# EasyEDA Pro project 430Backup.eprj

# Schematic 430Backup
Create Date: 2023-07-28; Page Name: P1; Project Name: 430Backup; Schematic Name: 430Backup; Update Date: 2023-07-28; Company: 嘉立创EDA; Page Size: A4; Version: V1.0
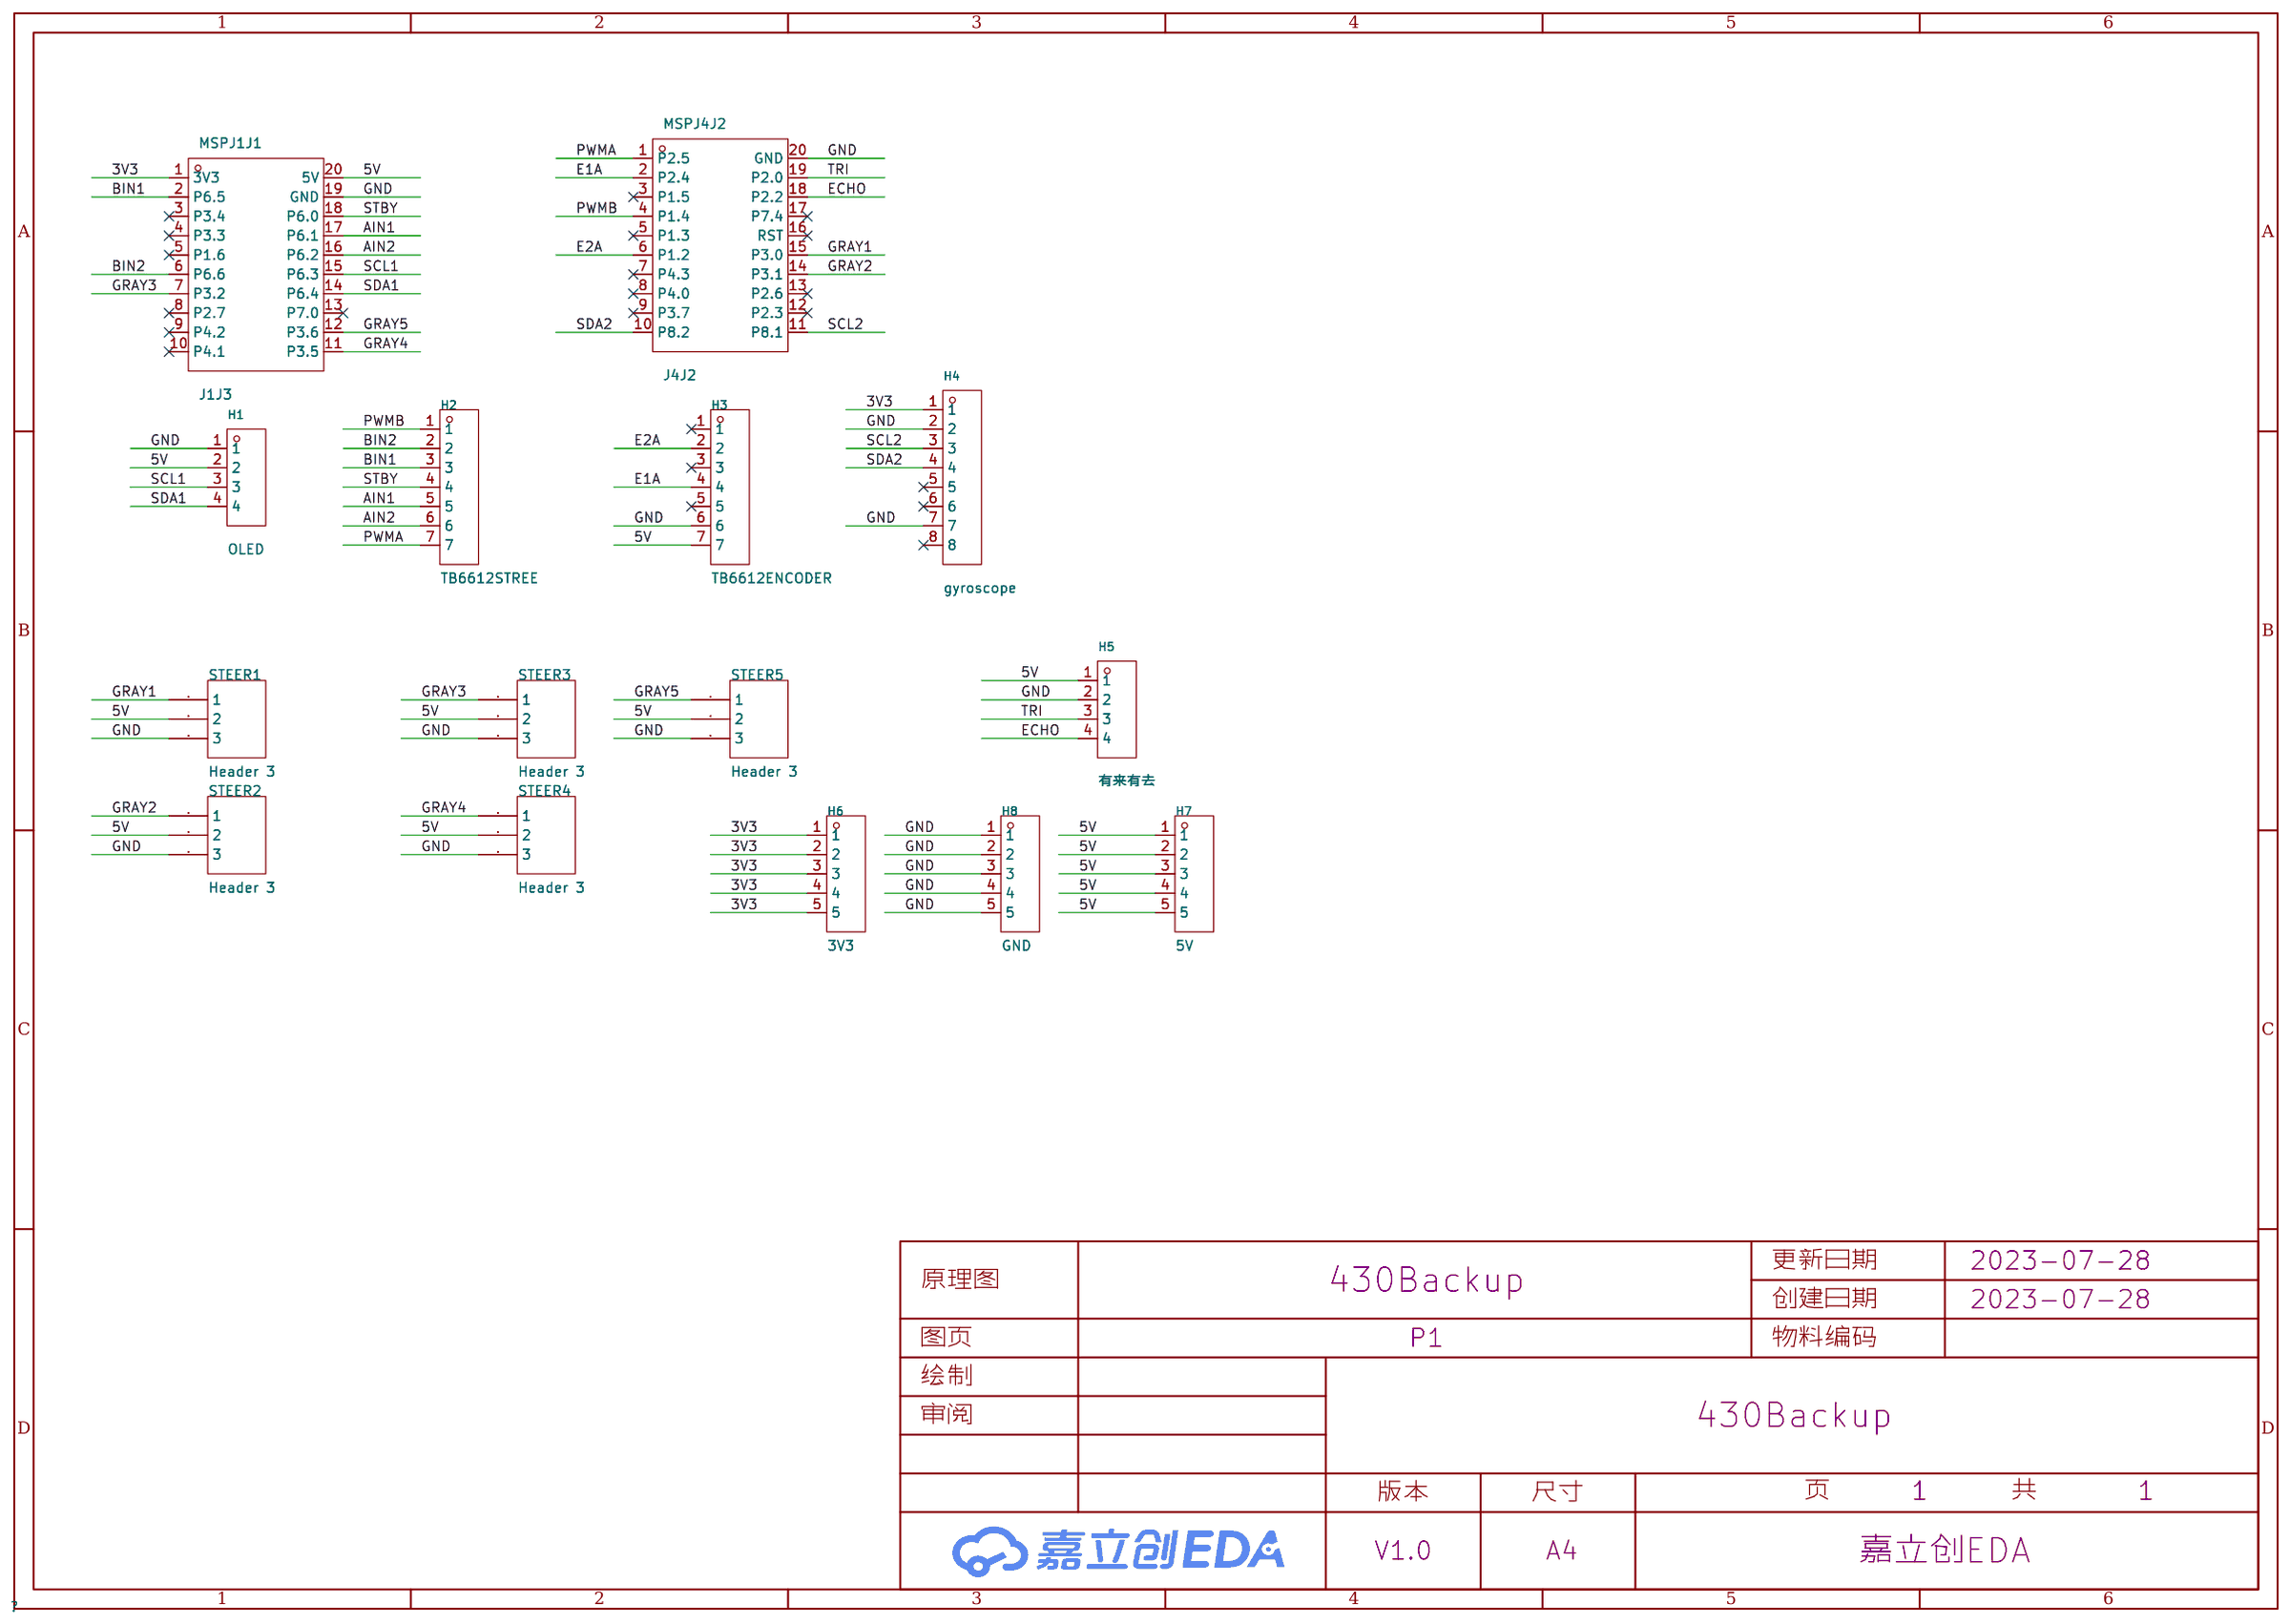
[diagram p0: schematic sheet]

## Parts
H1  OLED  [HDR-TH_4P-P2.00-V-M]
H2  TB6612STREE  [HDR-TH_7P-P2.54-V-M]
H3  TB6612ENCODER  [HDR-TH_7P-P2.54-V-M]
H4  gyroscope  [HDR-TH_8P-P2.00-V-M]
H5  有来有去  [HDR-TH_4P-P2.00-V-M]
H6  3V3  [HDR-TH_5P-P2.54-V-M]
H7  5V  [HDR-TH_5P-P2.54-V-M]
H8  GND  [HDR-TH_5P-P2.54-V-M]
MSPJ1J1  J1J3  [MSP_L]
MSPJ4J2  J4J2  [MSP_R]
STEER1  Header 3  [HDR1X3]
STEER2  Header 3  [HDR1X3]
STEER3  Header 3  [HDR1X3]
STEER4  Header 3  [HDR1X3]
STEER5  Header 3  [HDR1X3]

## Library data of the parts
H1 H5 = PZ200-1-04-Z: 排数:单排;总PIN位数:4;间距:2mm;插针结构:1x4P;行距:-;安装类型:直插;圆针/方针:方针;额定电流:1.5A;额定电压:-;配合针长度:4mm;塑高:2mm;端接针长度:2.8mm;工作温度范围:-40℃~+105℃;颜色:黑色;; LCSC Part Name: 2mm 1x4P 直插 方针; Supplier Part: C2905950; Manufacturer: HCTL(华灿天禄); Supplier Footprint: 直插,P=2mm; JLCPCB Part Class: 扩展库; Supplier: LCSC; Number of Rows: 单排; Number of Pins: 4; Pitch: 2mm; Pin Structure: 1x4P; Mounting Type: 直插; Circluar Pins/Square Pins: 方针; Current Rating (Max): 1.5A; Length of Mating Pin: 4mm; Insulation Height: 2mm; Length of End Connection Pin: 2.8mm; Operating Temperature Range: -40℃~+105℃; Color: 黑色
H2 H3 = KH-2.54PH180-1X7P-L11.5: 排数:单排;总PIN位数:7;间距:2.54mm;插针结构:1x7P;行距:-;安装类型:直插;圆针/方针:方针;额定电流:3A;额定电压:-;配合针长度:6mm;塑高:2.5mm;端接针长度:3mm;工作温度范围:-40℃~+105℃;颜色:黑色;; LCSC Part Name: 2.54mm 1x7P 直插 方针; Supplier Part: C2932700; Manufacturer: kinghelm(金航标); Supplier Footprint: 直插,P=2.54mm; JLCPCB Part Class: 扩展库; Supplier: LCSC; Number of Rows: 单排; Number of Pins: 7; Pitch: 2.54mm; Pin Structure: 1x7P; Mounting Type: 直插; Circluar Pins/Square Pins: 方针; Current Rating (Max): 3A; Length of Mating Pin: 6mm; Insulation Height: 2.5mm; Length of End Connection Pin: 3mm; Operating Temperature Range: -40℃~+105℃; Color: 黑色
H4 = KH-2PH180-1X8P-L8.7: 排数:单排;总PIN位数:8;间距:2mm;插针结构:1x8P;行距:-;安装类型:直插;圆针/方针:方针;额定电流:1.5A;额定电压:-;配合针长度:3.9mm;塑高:2mm;端接针长度:2.8mm;工作温度范围:-40℃~+105℃;颜色:-;; LCSC Part Name: 2mm 1x8P 直插 方针; Supplier Part: C2938453; Manufacturer: kinghelm(金航标); Supplier Footprint: 直插,P=2mm; JLCPCB Part Class: 扩展库; Supplier: LCSC; Number of Rows: 单排; Number of Pins: 8; Pitch: 2mm; Pin Structure: 1x8P; Mounting Type: 直插; Circluar Pins/Square Pins: 方针; Current Rating (Max): 1.5A; Length of Mating Pin: 3.9mm; Insulation Height: 2mm; Length of End Connection Pin: 2.8mm; Operating Temperature Range: -40℃~+105℃
H6-H8 = KH-2.54PH180-1X5P-L11.5: 排数:单排;总PIN位数:5;间距:2.54mm;插针结构:1x5P;行距:-;安装类型:直插;圆针/方针:方针;额定电流:3A;额定电压:-;配合针长度:6mm;塑高:2.5mm;端接针长度:3mm;工作温度范围:-40℃~+105℃;颜色:黑色;; LCSC Part Name: 2.54mm 1x5P 直插 方针; Supplier Part: C2932699; Manufacturer: kinghelm(金航标); Supplier Footprint: 直插,P=2.54mm; JLCPCB Part Class: 扩展库; Supplier: LCSC; Number of Rows: 单排; Number of Pins: 5; Pitch: 2.54mm; Pin Structure: 1x5P; Mounting Type: 直插; Circluar Pins/Square Pins: 方针; Current Rating (Max): 3A; Length of Mating Pin: 6mm; Insulation Height: 2.5mm; Length of End Connection Pin: 3mm; Operating Temperature Range: -40℃~+105℃; Color: 黑色
MSPJ1J1 = J1J3
MSPJ4J2 = J4J2
STEER1-STEER5 = Header 3: LatestRevisionDate: 17-Jul-2002; LatestRevisionNote: Re-released for DXP Platform.; Publisher: Altium Limited; Price(RMB): 0.00; Origin Footprint 2: XH2.54-3; Origin Footprint 3: VH3.96-3; Origin Footprint 4: PH2.0-3; Origin Footprint 5: GH1.25T-3P; Origin Footprint 6: XH2.54-3-L; Origin Footprint 7: XH2.54-WS-3P; Origin Footprint 8: MX1.25T-3P-H; Origin Footprint 9: MX1.25T-3P-V

## Nets
3V3: H4.1 H6.1 H6.2 H6.3 H6.4 H6.5 MSPJ1J1.1(3V3)
5V: H1.2 H3.7 H5.1 H7.1 H7.2 H7.3 H7.4 H7.5 MSPJ1J1.20(5V) STEER1.2 STEER2.2 STEER3.2 STEER4.2 STEER5.2
GND: H1.1 H3.6 H4.2 H4.7 H5.2 H8.1 H8.2 H8.3 H8.4 H8.5 MSPJ1J1.19(GND) MSPJ4J2.20(GND) STEER1.3 STEER2.3 STEER3.3 STEER4.3 STEER5.3
AIN1: H2.5 MSPJ1J1.17(P6.1)
AIN2: H2.6 MSPJ1J1.16(P6.2)
BIN1: H2.3 MSPJ1J1.2(P6.5)
BIN2: H2.2 MSPJ1J1.6(P6.6)
E1A: H3.4 MSPJ4J2.2(P2.4)
E2A: H3.2 MSPJ4J2.6(P1.2)
ECHO: H5.4 MSPJ4J2.18(P2.2)
GRAY1: MSPJ4J2.15(P3.0) STEER1.1
GRAY2: MSPJ4J2.14(P3.1) STEER2.1
GRAY3: MSPJ1J1.7(P3.2) STEER3.1
GRAY4: MSPJ1J1.11(P3.5) STEER4.1
GRAY5: MSPJ1J1.12(P3.6) STEER5.1
PWMA: H2.7 MSPJ4J2.1(P2.5)
PWMB: H2.1 MSPJ4J2.4(P1.4)
SCL1: H1.3 MSPJ1J1.15(P6.3)
SCL2: H4.3 MSPJ4J2.11(P8.1)
SDA1: H1.4 MSPJ1J1.14(P6.4)
SDA2: H4.4 MSPJ4J2.10(P8.2)
STBY: H2.4 MSPJ1J1.18(P6.0)
TRI: H5.3 MSPJ4J2.19(P2.0)

Not connected (* = marked no-connect by the designer): H3 1* 3* 5*; H4 5* 6* 8*; MSPJ1J1 3(P3.4)* 4(P3.3)* 5(P1.6)* 8(P2.7)* 9(P4.2)* 10(P4.1)* 13(P7.0)*; MSPJ4J2 3(P1.5)* 5(P1.3)* 7(P4.3)* 8(P4.0)* 9(P3.7)* 12(P2.3)* 13(P2.6)* 16(RST)* 17(P7.4)*

# Board 430Backup
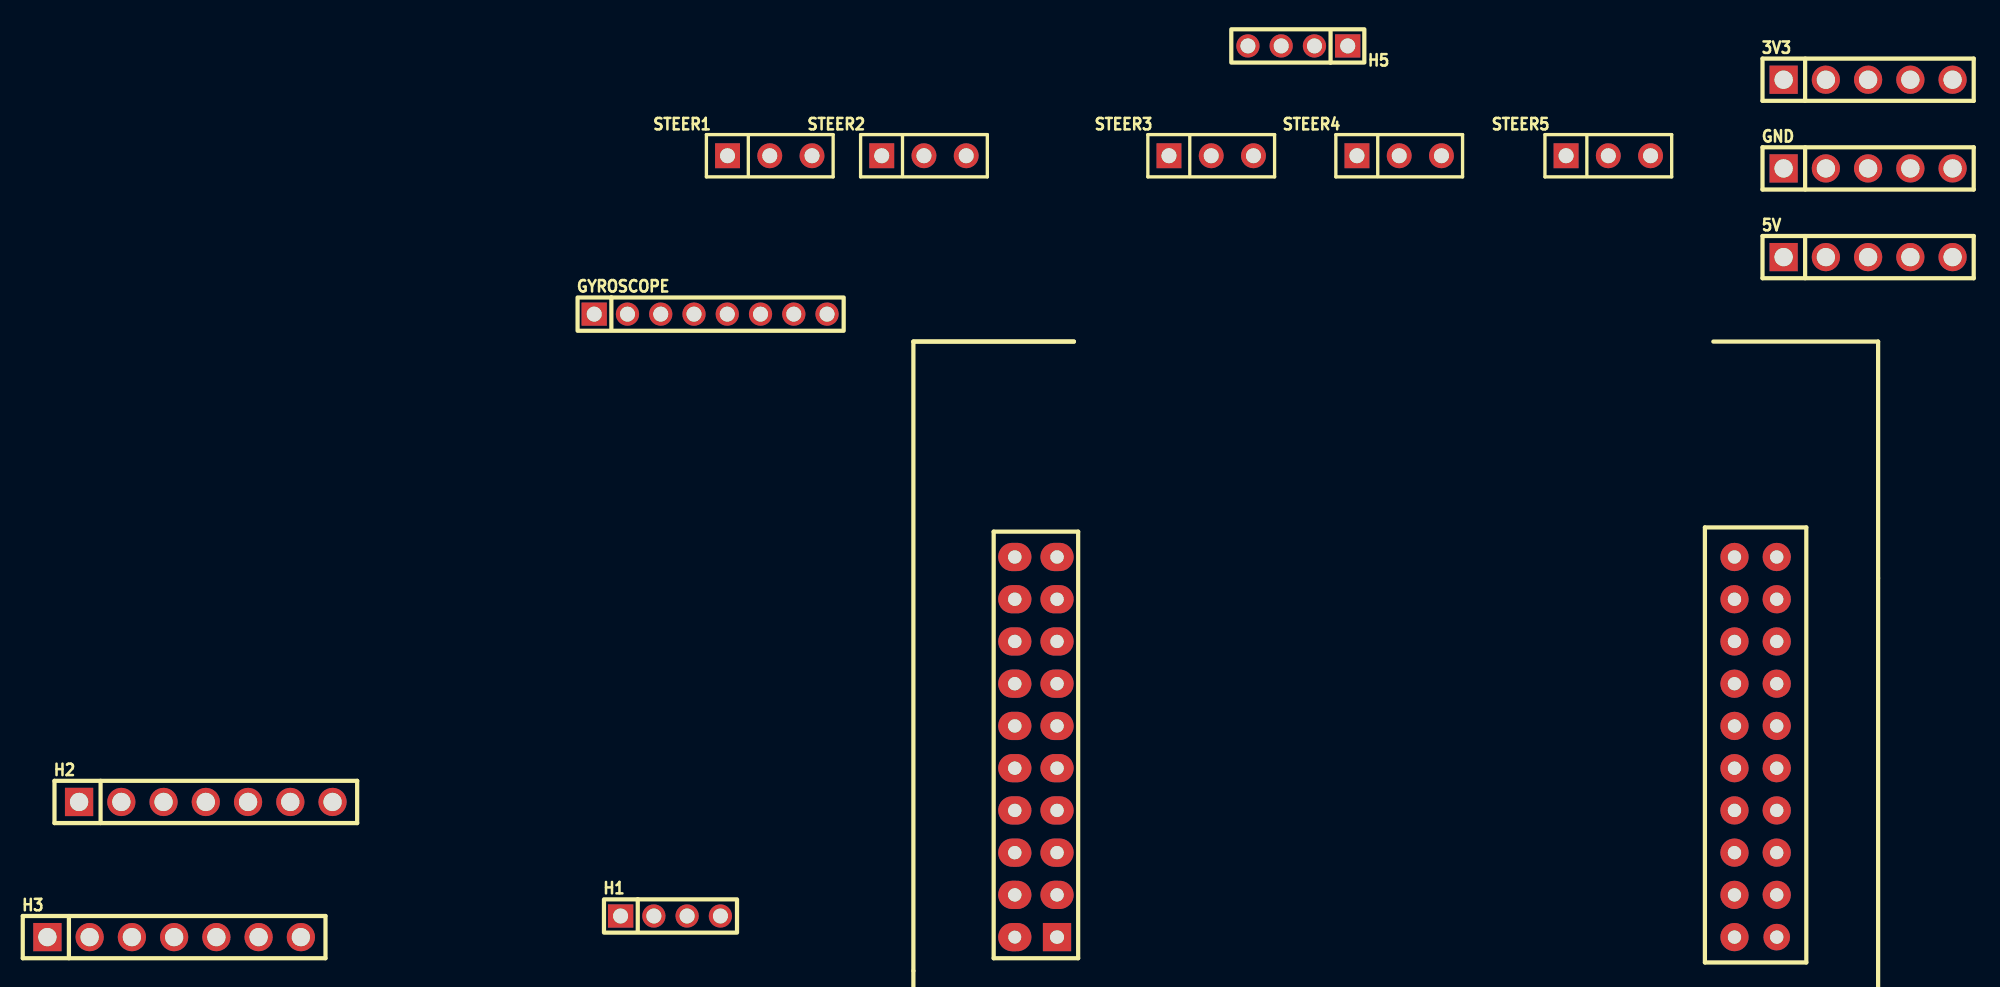
[diagram p1: board, top side]
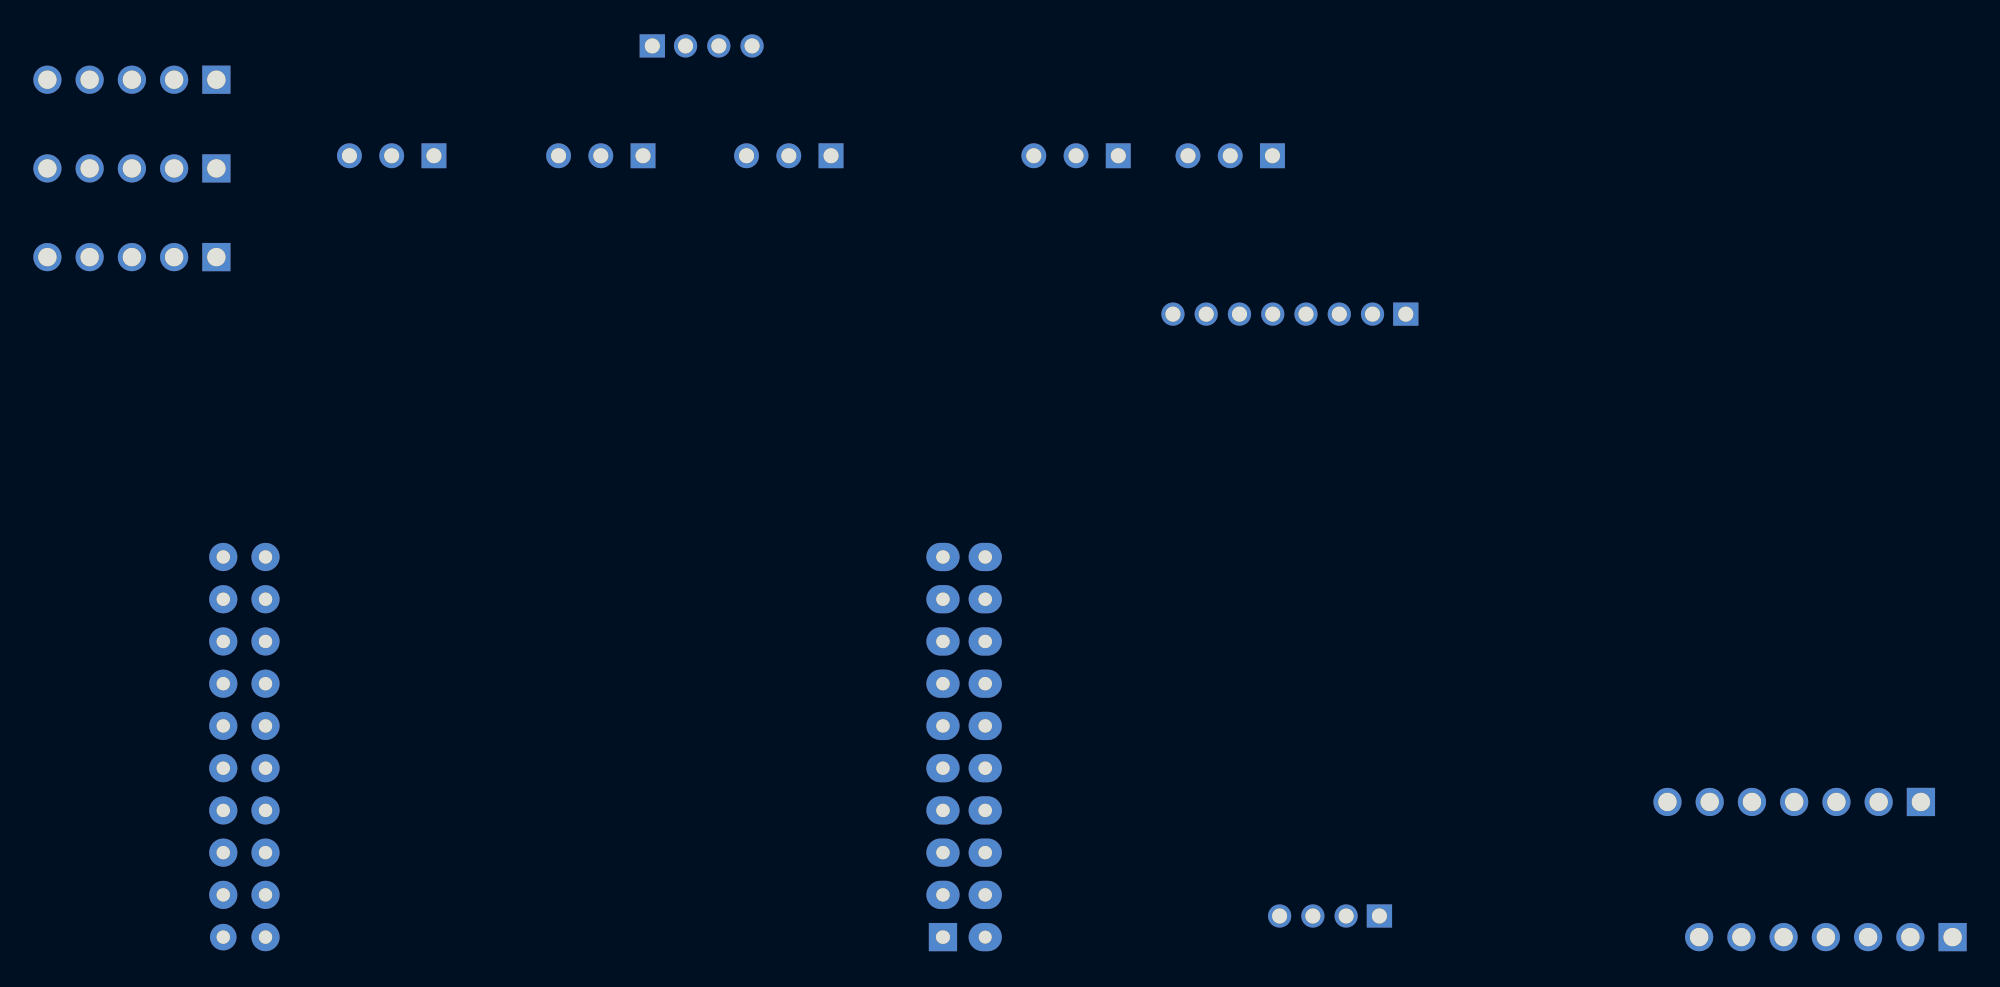
[diagram p2: board, bottom side, seen from below]

No outline. copper layers: Top Layer, Inner3, Inner4, Inner5, Inner6, Inner7, Inner8, Inner9, Inner10, Inner11, Inner12, Inner13, Inner14, Inner15, Inner16, Inner17, Inner18, Inner19, Inner20, Inner21, Inner22, Inner23, Inner24, Inner25, Inner26, Inner27, Inner28, Inner29, Inner30, Bottom Layer. Coordinates in mm from the lowest, leftmost part position.
Stack: Top Layer 0.035mm / Dielectric1 1.51mm FR4 er 4.5 / Bottom Layer 0.035mm

## Design rules (mm)
template: JLCPCB Capability(Two Layers Board)
spacing copperThickness1oz (default): track to track 0.102, other pairs 0.152 to 0.3
spacing copperThickness2oz: track to track 0.203, other pairs 0.152 to 0.3
track width copperThickness1oz (default): min 0.127, default 0.254, max 2.54
track width copperThickness2oz: min 0.203, default 0.254, max 2.54
differential pair differentialPair (default): width min 0.127, default 0.254, max 2.54; gap min 0.152, default 0.152
via viaSize (default): diameter min 0.5, default 0.61, max 10; hole min 0.3, default 0.305, max 6.3

## Placement (name value [footprint] x y rotation side)
3V3  3V3  [HDR-TH_5P-P2.54-V-M]  101.85 51.56 0 top
5V  5V  [HDR-TH_5P-P2.54-V-M]  101.85 40.89 0 top
GND  GND  [HDR-TH_5P-P2.54-V-M]  101.85 46.23 0 top
GYROSCOPE  gyroscope  [HDR-TH_8P-P2.00-V-M]  32.26 37.47 0 top
H1  OLED  [HDR-TH_4P-P2.00-V-M]  29.84 1.27 0 top
H2  TB6612STREE  [HDR-TH_7P-P2.54-V-M]  1.91 8.13 0 top
H3  TB6612ENCODER  [HDR-TH_7P-P2.54-V-M]  0 0 0 top
H5  有来有去  [HDR-TH_4P-P2.00-V-M]  67.56 53.59 180 top
MSPJ1J1  J1J3  [MSP_L]  92.55 11.43 180 top
MSPJ4J2  J4J2  [MSP_R]  53.09 0 180 top
STEER1  Header 3  [HDR1X3]  33.27 46.99 0 top
STEER2  Header 3  [HDR1X3]  42.55 46.99 0 top
STEER3  Header 3  [HDR1X3]  59.82 46.99 0 top
STEER4  Header 3  [HDR1X3]  71.12 46.99 0 top
STEER5  Header 3  [HDR1X3]  83.69 46.99 0 top

## Footprints (pads in the part's own frame, mm; a bottom-side part is the same pattern mirrored in y, then rotated)
HDR1X3
  rect 1.5x1.5 hole 0.9: 1(0,0)
  round 1.5 hole 0.9: 2(2.54,0) 3(5.08,0)
HDR-TH_4P-P2.00-V-M
  rect 1.524x1.4 hole 0.9: 1(-3,0)
  round 1.4 hole 0.9: 2(-1,0) 3(1,0) 4(3,0)
HDR-TH_5P-P2.54-V-M
  rect 1.7x1.7 hole 1.1: 1(-5.08,0)
  round 1.7 hole 1.1: 2(-2.54,0) 3(0,0) 4(2.54,0) 5(5.08,0)
HDR-TH_7P-P2.54-V-M
  rect 1.7x1.7 hole 1.1: 1(-7.62,0)
  round 1.7 hole 1.1: 2(-5.08,0) 3(-2.54,0) 4(0,0) 5(2.54,0) 6(5.08,0) 7(7.62,0)
HDR-TH_8P-P2.00-V-M
  rect 1.524x1.4 hole 0.9: 1(-7,0)
  round 1.4 hole 0.9: 2(-5,0) 3(-3,0) 4(-1,0) 5(1,0) 6(3,0) 7(5,0) 8(7,0)
MSP_L
  round 1.6 hole 0.8: 1(-3.81,11.43)
  round 1.7 hole 0.8: 2(-3.81,8.89) 3(-3.81,6.35) 4(-3.81,3.81) 5(-3.81,1.27) 6(-3.81,-1.27) 7(-3.81,-3.81) 8(-3.81,-6.35) 9(-3.81,-8.89) 10(-3.81,-11.43) 11(-1.27,-11.43) 12(-1.27,-8.89) 13(-1.27,-6.35) 14(-1.27,-3.81) 15(-1.27,-1.27) 16(-1.27,1.27) 17(-1.27,3.81) 18(-1.27,6.35) 19(-1.27,8.89) 20(-1.27,11.43)
MSP_R
  rect 1.7x1.7 hole 0.84x0.8: 1(0,0)
  oval 2x1.7 hole 0.805x0.8: 2(0,-2.54) 3(0,-5.08) 4(0,-7.62) 5(0,-10.16) 6(0,-12.7) 7(0,-15.24) 8(0,-17.78) 9(0,-20.32) 10(0,-22.86) 11(2.54,-22.86) 12(2.54,-20.32) 13(2.54,-17.78) 14(2.54,-15.24) 15(2.54,-12.7) 16(2.54,-10.16) 17(2.54,-7.62) 18(2.54,-5.08) 19(2.54,-2.54)
  oval 2x1.7 hole 0.775: 20(2.54,0)

## Nets
3V3: 3V3.1 3V3.2 3V3.3 3V3.4 3V3.5 GYROSCOPE.1 MSPJ1J1.1
5V: 5V.1 5V.2 5V.3 5V.4 5V.5 H1.2 H3.7 H5.1 MSPJ1J1.20 STEER1.2 STEER2.2 STEER3.2 STEER4.2 STEER5.2
GND: GND.1 GND.2 GND.3 GND.4 GND.5 GYROSCOPE.2 GYROSCOPE.7 H1.1 H3.6 H5.2 MSPJ1J1.19 MSPJ4J2.20 STEER1.3 STEER2.3 STEER3.3 STEER4.3 STEER5.3
AIN1: H2.5 MSPJ1J1.17
AIN2: H2.6 MSPJ1J1.16
BIN1: H2.3 MSPJ1J1.2
BIN2: H2.2 MSPJ1J1.6
E1A: H3.4 MSPJ4J2.2
E2A: H3.2 MSPJ4J2.6
ECHO: H5.4 MSPJ4J2.18
GRAY1: MSPJ4J2.15 STEER1.1
GRAY2: MSPJ4J2.14 STEER2.1
GRAY3: MSPJ1J1.7 STEER3.1
GRAY4: MSPJ1J1.11 STEER4.1
GRAY5: MSPJ1J1.12 STEER5.1
PWMA: H2.7 MSPJ4J2.1
PWMB: H2.1 MSPJ4J2.4
SCL1: H1.3 MSPJ1J1.15
SCL2: GYROSCOPE.3 MSPJ4J2.11
SDA1: H1.4 MSPJ1J1.14
SDA2: GYROSCOPE.4 MSPJ4J2.10
STBY: H2.4 MSPJ1J1.18
TRI: H5.3 MSPJ4J2.19

Pads without a net: GYROSCOPE 5 6 8; H3 1 3 5; MSPJ1J1 3 4 5 8 9 10 13; MSPJ4J2 3 5 7 8 9 12 13 16 17
